# EAGLE design nolleblink2012_final (EAGLE 5.11)
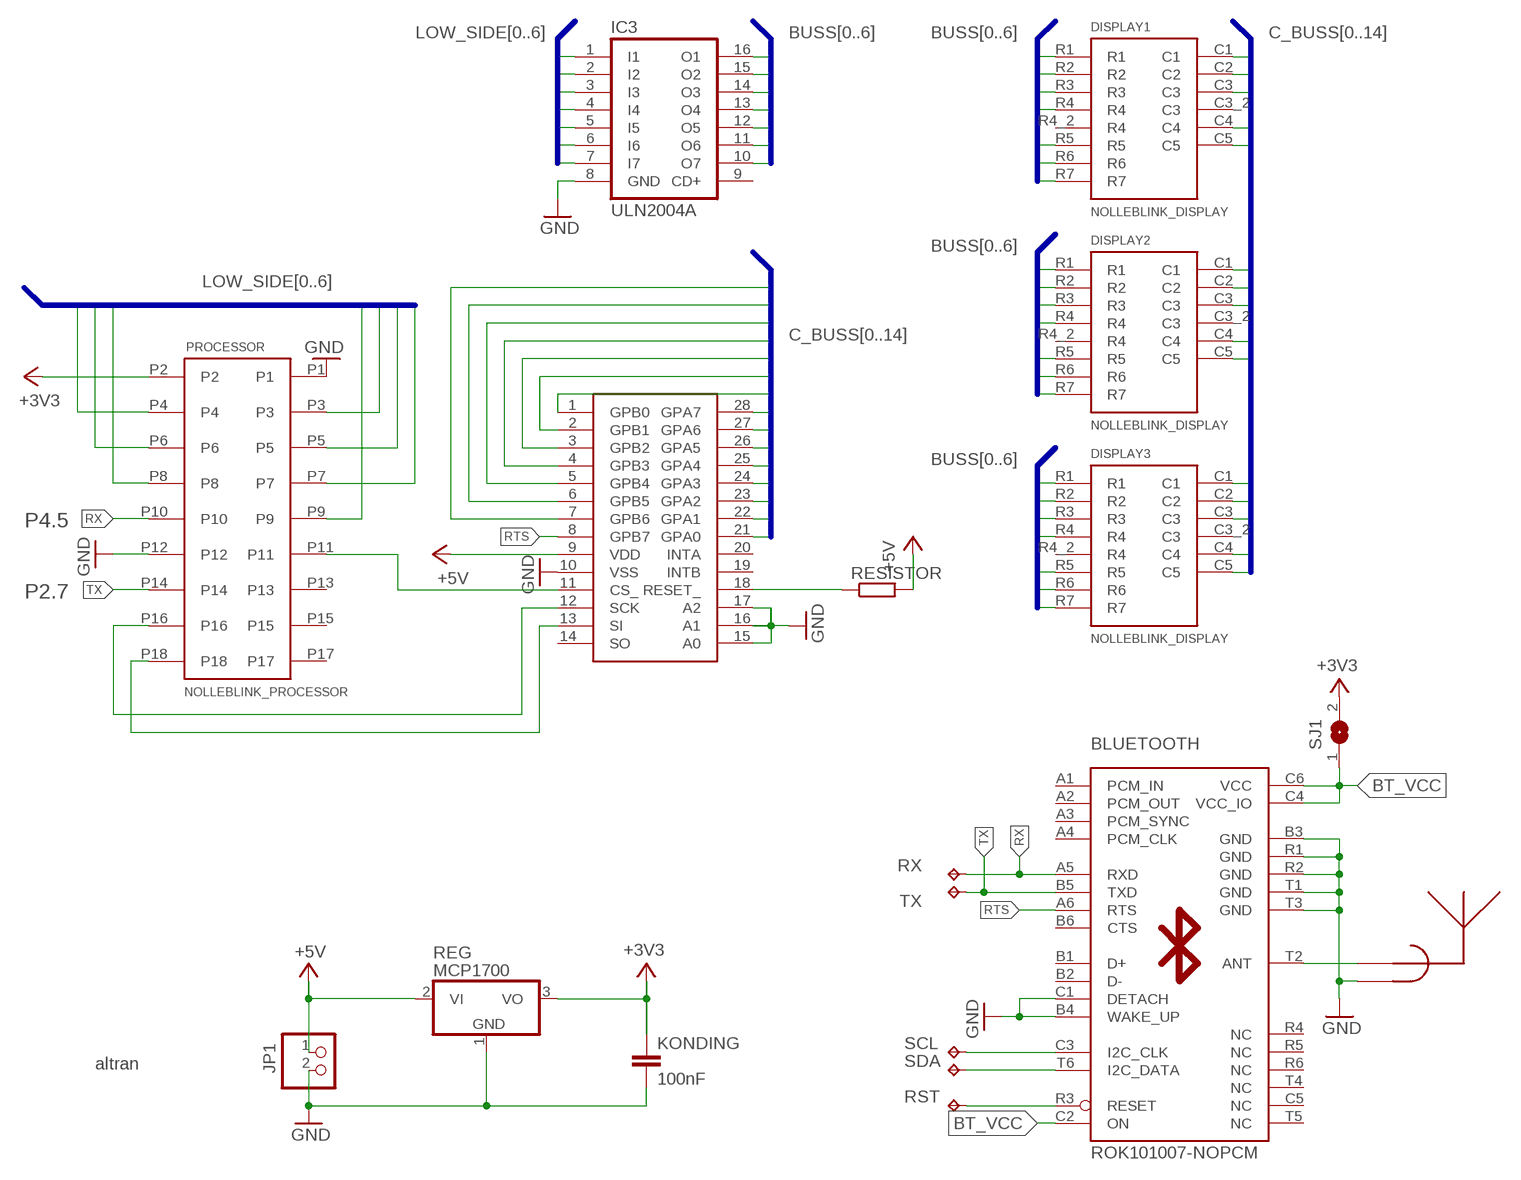
[diagram p0: schematic, sheet 1]

## Parts
BLUETOOTH  ROK101007-NOPCM  [ROK101007_NOPCM]
DISPLAY1  NOLLEBLINK_DISPLAY  [KINGBRIGHT_TA12-11EWA]
DISPLAY2  NOLLEBLINK_DISPLAY  [KINGBRIGHT_TA12-11EWA]
DISPLAY3  NOLLEBLINK_DISPLAY  [KINGBRIGHT_TA12-11EWA]
IC2  MCPS23S17  [MCP23S17]
IC3  ULN2004A  ULN2004AN  [DIL16]
JP1  PINHD-1X2  [1X02]
KONDING  100nF  C-EU050-030X075  [C050-030X075]
PROCESSOR  NOLLEBLINK_PROCESSOR  [CON_18_NOLLEBLINK]
REG  MCP1700  MCP_REGULATOR  [TO92_REGULATOR]
RESISTOR  R-EU_0207/10  [0207/10]
RST  TPTP12SQ  [TP12SQ]
RX  TPTP20SQ  [TP20SQ]
SCL  TPTP12SQ  [TP12SQ]
SDA  TPTP12SQ  [TP12SQ]
SJ1  SJ  [SJ]
TX  TPTP20SQ  [TP20SQ]
U$1  ALTRAN  [ALTRAN]
U$3  INV_F_24  [INV_F_ANTENNA]

## Nets
+3V3: KONDING.1 PROCESSOR.P2 REG.3(VO) SJ1.2
+5V: IC2.9(VDD) JP1.1 REG.2(VI) RESISTOR.2
BT_VCC: BLUETOOTH.C2(ON) BLUETOOTH.C4(VCC_IO) BLUETOOTH.C6(VCC) SJ1.1
BUSS0: DISPLAY1.R1 DISPLAY2.R1 DISPLAY3.R1 IC3.16(O1)
BUSS1: DISPLAY1.R2 DISPLAY2.R2 DISPLAY3.R2 IC3.15(O2)
BUSS2: DISPLAY1.R3 DISPLAY2.R3 DISPLAY3.R3 IC3.14(O3)
BUSS3: DISPLAY1.R4 DISPLAY2.R4 DISPLAY3.R4 IC3.13(O4)
BUSS4: DISPLAY1.R5 DISPLAY2.R5 DISPLAY3.R5 IC3.12(O5)
BUSS5: DISPLAY1.R6 DISPLAY2.R6 DISPLAY3.R6 IC3.11(O6)
BUSS6: DISPLAY1.R7 DISPLAY2.R7 DISPLAY3.R7 IC3.10(O7)
C_BUSS0: DISPLAY1.C1 IC2.21(GPA0)
C_BUSS1: DISPLAY1.C2 IC2.22(GPA1)
C_BUSS2: DISPLAY1.C3 IC2.23(GPA2)
C_BUSS3: DISPLAY1.C4 IC2.24(GPA3)
C_BUSS4: DISPLAY1.C5 IC2.25(GPA4)
C_BUSS5: DISPLAY2.C1 IC2.26(GPA5)
C_BUSS6: DISPLAY2.C2 IC2.27(GPA6)
C_BUSS7: DISPLAY2.C3 IC2.28(GPA7)
C_BUSS8: DISPLAY2.C4 IC2.1(GPB0)
C_BUSS9: DISPLAY2.C5 IC2.2(GPB1)
C_BUSS10: DISPLAY3.C1 IC2.3(GPB2)
C_BUSS11: DISPLAY3.C2 IC2.4(GPB3)
C_BUSS12: DISPLAY3.C3 IC2.5(GPB4)
C_BUSS13: DISPLAY3.C4 IC2.6(GPB5)
C_BUSS14: DISPLAY3.C5 IC2.7(GPB6)
GND: BLUETOOTH.B3(GND) BLUETOOTH.B4(WAKE_UP) BLUETOOTH.C1(DETACH) BLUETOOTH.R1(GND) BLUETOOTH.R2(GND) BLUETOOTH.T1(GND) BLUETOOTH.T3(GND) IC2.10(VSS) IC2.15(A0) IC2.16(A1) IC2.17(A2) IC3.8(GND) JP1.2 KONDING.2 PROCESSOR.P1 PROCESSOR.P12 REG.1(GND) U$3.GND
LOW_SIDE0: IC3.7(I7) PROCESSOR.P3
LOW_SIDE1: IC3.6(I6) PROCESSOR.P4
LOW_SIDE2: IC3.5(I5) PROCESSOR.P5
LOW_SIDE3: IC3.4(I4) PROCESSOR.P6
LOW_SIDE4: IC3.3(I3) PROCESSOR.P7
LOW_SIDE5: IC3.2(I2) PROCESSOR.P8
LOW_SIDE6: IC3.1(I1) PROCESSOR.P9
N$1: IC2.11(CS_) PROCESSOR.P11
N$2: IC2.13(SI) PROCESSOR.P18
N$3: IC2.12(SCK) PROCESSOR.P16
N$4: IC2.18(RESET_) RESISTOR.1
N$5: BLUETOOTH.T2(ANT) U$3.FEED(RF)
N$6: BLUETOOTH.C3(I2C_CLK) SCL.TP
N$7: BLUETOOTH.T6(I2C_DATA) SDA.TP
N$8: BLUETOOTH.R3(RESET) RST.TP
RTS: BLUETOOTH.A6(RTS) IC2.8(GPB7)
RX: BLUETOOTH.A5(RXD) PROCESSOR.P10 RX.TP
TX: BLUETOOTH.B5(TXD) PROCESSOR.P14 TX.TP
Unconnected: BLUETOOTH.A1(PCM_IN) BLUETOOTH.A2(PCM_OUT) BLUETOOTH.A3(PCM_SYNC) BLUETOOTH.A4(PCM_CLK) BLUETOOTH.B1(D+) BLUETOOTH.B2(D-) BLUETOOTH.B6(CTS) BLUETOOTH.C5(NC) BLUETOOTH.R4(NC) BLUETOOTH.R5(NC) BLUETOOTH.R6(NC) BLUETOOTH.T4(NC) BLUETOOTH.T5(NC) DISPLAY1.C3_2(C3) DISPLAY1.R4_2(R4) DISPLAY2.C3_2(C3) DISPLAY2.R4_2(R4) DISPLAY3.C3_2(C3) DISPLAY3.R4_2(R4) IC2.14(SO) IC2.19(INTB) IC2.20(INTA) IC3.9(CD+) PROCESSOR.P13 PROCESSOR.P15 PROCESSOR.P17

## Buses
BUSS[0..6]
LOW_SIDE[0..6]
C_BUSS[0..14]

## Notes on the sheet
- P4.5
- P2.7

## Library data of the parts
BLUETOOTH = etf-ericsson-bluetooth:ROK101007: Ericsson ROK 101 007 Bluetooth Module F*ck yeah! 110215 kongo@etf.nu
DISPLAY1-DISPLAY3 = stefan:NOLLEBLINK_DISPLAY: Nolleblinkmojt Display 2009 www.etf.nu
IC2 = microchip2:MCPS23S17
IC3 = uln-udn:ULN2004A: DRIVER ARRAY
JP1 = pinhead:PINHD-1X2: PIN HEADER
KONDING = rcl:C-EU: CAPACITOR, European symbol
PROCESSOR = stefan:NOLLEBLINK_PROCESSOR: Texas Instruments Development Board Nolleblinkmojt 2009 www.etf.nu
REG = ag:MCP_REGULATOR
RESISTOR = rcl:R-EU_: RESISTOR, European symbol
RST RX SCL SDA TX = testpad:TP: Test pad
SJ1 = jumper:SJ: SMD solder JUMPER
U$1 = mine:ALTRAN
U$3 = inverted_f:INV_F_24

## Board
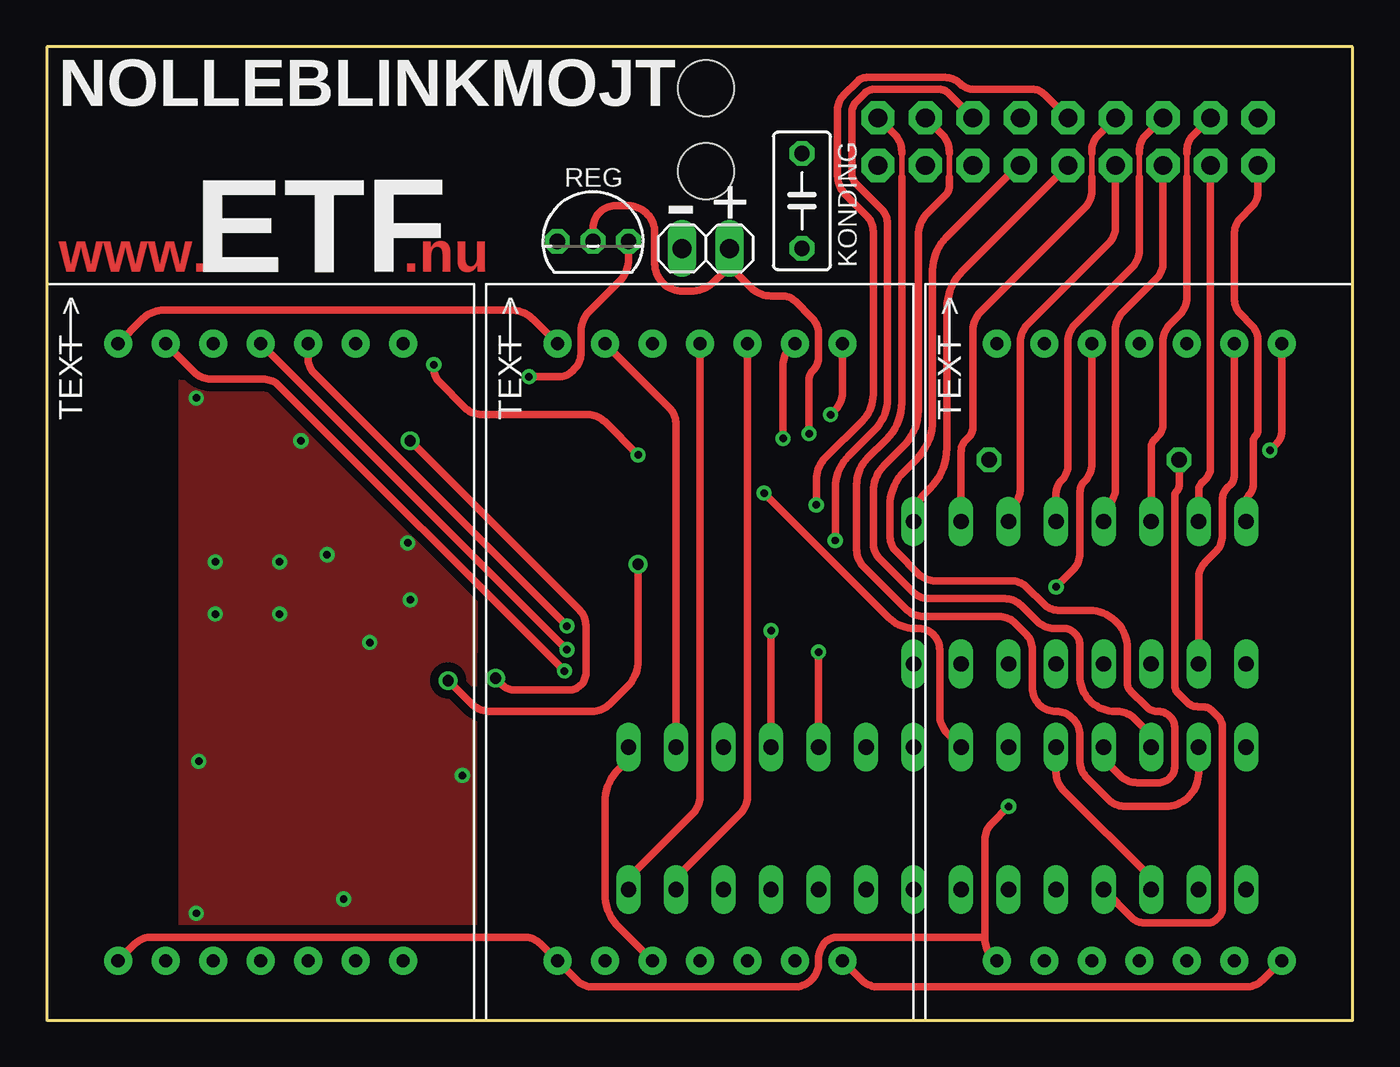
[diagram p1: board, top side]
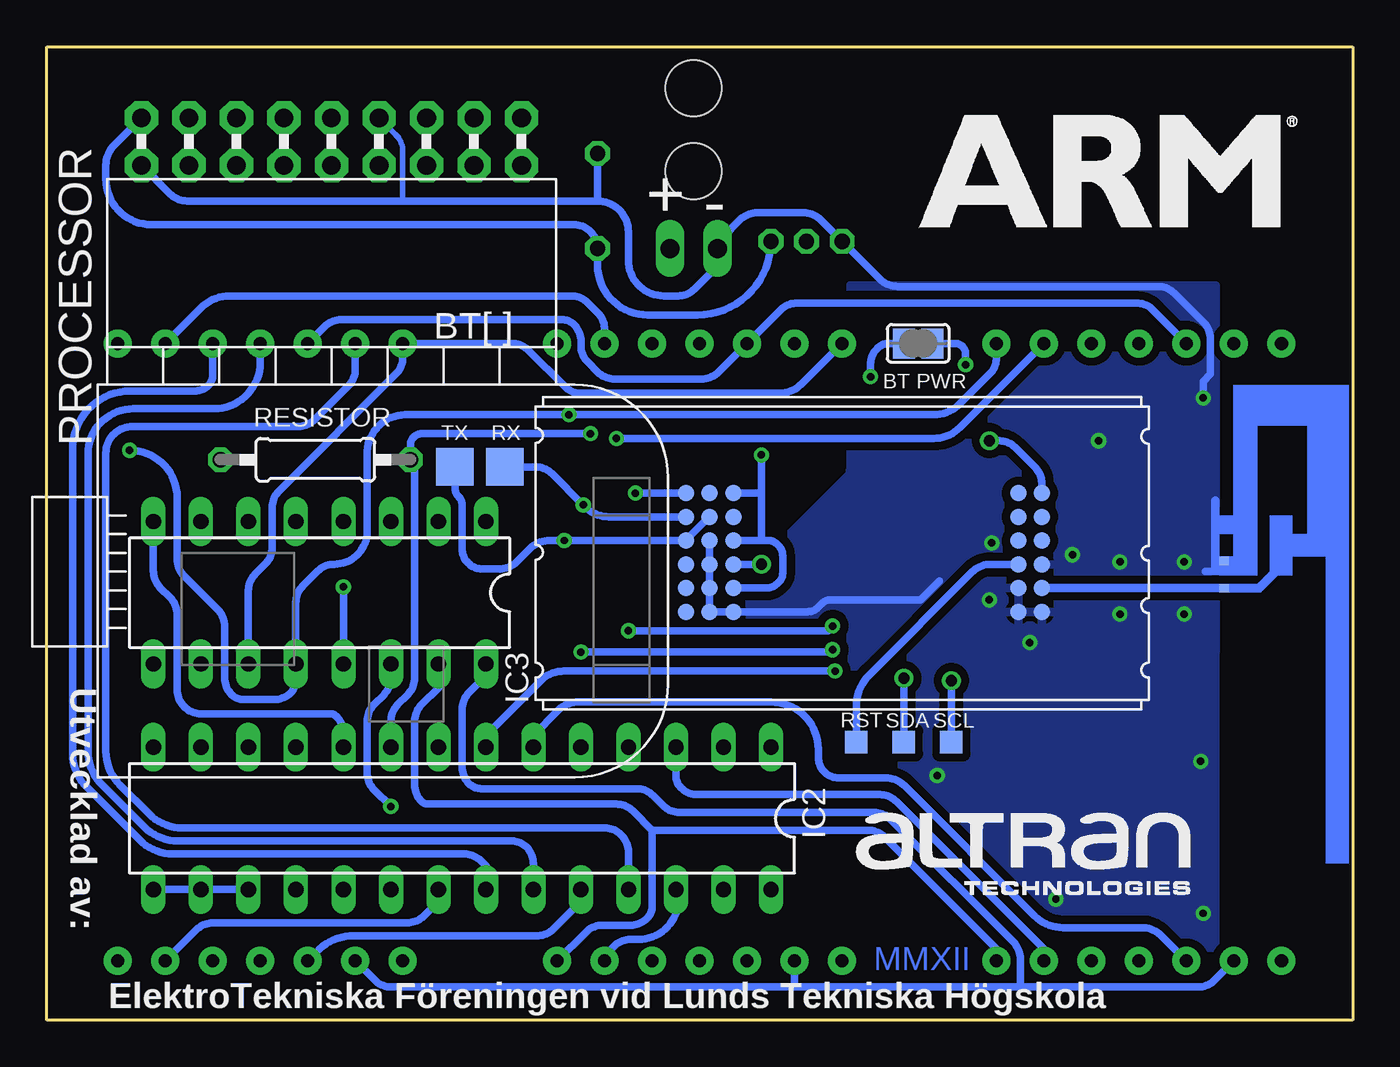
[diagram p2: board, bottom side, seen from below]

Size 69.84 x 52.06 mm. Coordinates in mm from the lower left corner, seen from the top.
Outline: 0,0 69.84,0 69.84,52.06 0,52.06 0,0
Copper layers (1*16): Top 0.035mm / dielectric 1.5mm / Bottom 0.035mm
Design rules "default": minimum track width 10mil, minimum drill 24mil, track to track 8mil, track to pad 8mil, pad to pad 8mil, via to via 8mil, smd to smd 8mil, copper to edge 40mil, drill to drill 8mil, minimum pad ring 10mil, minimum via ring 8mil, stop-mask expansion 4mil, vias tented up to drill 0mil, thermal gap 10mil
Holes 3 mm at 35.24,49.85 35.24,45.4

### Footprints (pad centres in the part's own frame; a part is rotated, then mirrored left to right if it is on the bottom)
ROK101007_NOPCM = smd 0.889 x 0.889: A1 24.76,-3.12; A2 24.76,-4.39; A3 24.76,-5.66; A4 24.76,-6.93; A5 24.76,-8.2; A6 24.76,-9.47; B1 23.5,-3.12; B2 23.5,-4.39; B3 23.5,-5.66; B4 23.5,-6.93; B5 23.5,-8.2; B6 23.5,-9.47; C1 22.22,-3.12; C2 22.22,-4.39; C3 22.22,-5.66; C4 22.22,-6.93; C5 22.22,-8.2; C6 22.22,-9.47; R1 6.98,-3.12; R2 6.98,-4.39; R3 6.98,-5.66; R4 6.98,-6.93; R5 6.98,-8.2; R6 6.98,-9.47; T1 5.72,-3.12; T2 5.72,-4.39; T3 5.72,-5.66; T4 5.72,-6.93; T5 5.72,-8.2; T6 5.72,-9.47
KINGBRIGHT_TA12-11EWA = drill 0.7 pad 1.5 round: C1 5.08,-16.51; C2 2.54,16.51; C3 0,16.51; C3_2 0,-16.51; C4 -2.54,-16.51; C5 -5.08,16.51; R1 -5.08,-16.51; R2 7.62,-16.51; R3 -7.62,-16.51; R4 -2.54,16.51; R4_2 2.54,-16.51; R5 7.62,16.51; R6 -7.62,16.51; R7 5.08,16.51
MCP23S17 = drill 0.813 long: 1 -12.7,-3.81; 2 -10.16,-3.81; 3 -7.62,-3.81; 4 -5.08,-3.81; 5 -2.54,-3.81; 6 0,-3.81; 7 2.54,-3.81; 8 5.08,-3.81; 9 7.62,-3.81; 10 10.16,-3.81; 11 12.7,-3.81; 12 15.24,-3.81; 13 17.78,-3.81; 14 20.32,-3.81; 15 20.32,3.81; 16 17.78,3.81; 17 15.24,3.81; 18 12.7,3.81; 19 10.16,3.81; 20 7.62,3.81; 21 5.08,3.81; 22 2.54,3.81; 23 0,3.81; 24 -2.54,3.81; 25 -5.08,3.81; 26 -7.62,3.81; 27 -10.16,3.81; 28 -12.7,3.81
DIL16 = drill 0.813 long: 1 -8.89,-3.81; 2 -6.35,-3.81; 3 -3.81,-3.81; 4 -1.27,-3.81; 5 1.27,-3.81; 6 3.81,-3.81; 7 6.35,-3.81; 8 8.89,-3.81; 9 8.89,3.81; 10 6.35,3.81; 11 3.81,3.81; 12 1.27,3.81; 13 -1.27,3.81; 14 -3.81,3.81; 15 -6.35,3.81; 16 -8.89,3.81
1X02 = drill 1.016 long: 1 -1.27,0; 2 1.27,0
C050-030X075 = drill 0.813 octagon: 1 -2.54,0; 2 2.54,0
CON_18_NOLLEBLINK = drill 1 pad 1.778 octagon: P1 10.16,1.27; P2 10.16,-1.27; P3 7.62,1.27; P4 7.62,-1.27; P5 5.08,1.27; P6 5.08,-1.27; P7 2.54,1.27; P8 2.54,-1.27; P9 0,1.27; P10 0,-1.27; P11 -2.54,1.27; P12 -2.54,-1.27; P13 -5.08,1.27; P14 -5.08,-1.27; P15 -7.62,1.27; P16 -7.62,-1.27; P17 -10.16,1.27; P18 -10.16,-1.27
TO92_REGULATOR = drill 0.813 octagon: 1 -1.905,0; 2 0,0; 3 1.905,0
0207/10 = drill 0.813 octagon: 1 -5.08,0; 2 5.08,0
TP12SQ = smd 1.2 x 1.2: TP 0,0
TP20SQ = smd 2 x 2: TP 0,0
SJ = smd 1.168 x 1.6: 1 -0.762,0; 2 0.762,0
INV_F_ANTENNA = smd 0.46 x 0.5: FEED 10.86,0.253; GND 9.413,0.25

### Placement (x,y rotation side)
BLUETOOTH  10.9,18.72 180 bottom
DISPLAY1  58.42,19.68 0 top
DISPLAY2  34.92,19.68 0 top
DISPLAY3  11.43,19.68 0 top
IC2  43.81,10.79 180 bottom
IC3  55.24,22.86 180 bottom
JP1  35.24,41.27 180 top
KONDING  40.39,43.81 90 top
PROCESSOR  54.61,46.99 180 bottom
REG  29.21,41.66 0 top
RESISTOR  55.47,29.97 0 bottom
RST  26.54,14.86 0 bottom
RX  45.34,29.59 0 bottom
SCL  21.46,14.86 90 bottom
SDA  24,14.86 90 bottom
SJ1  23.24,36.2 180 bottom
TX  48.01,29.59 0 bottom
U$1  5.33,3.79 0 top
U$2  [ARM]  13.2,44.96 0 bottom
U$3  7.13,33.97 270 bottom

### Tracks (layer width: path | path; a pad name or v marks a point on that pad's centre or on a via)
+3V3  (via drill 0.4)
  Top 0.406: v25.78,34.42 27.39,34.42 arc45 28.11,34.72 28.21,34.81 arc45 28.57,35.7 28.57,36.85 arc-45 29.01,37.9 30.63,39.52 arc45 31.11,40.69 REG.3
  Bottom 0.305: 65.4,47.63 PROCESSOR.P2 | 64.14,42.55 64.24,42.55
  Bottom 0.406: REG.3 arc90 35.05,37.72 37.71,37.72 arc90 40.39,40.39 KONDING.1 arc-90 41.66,42.55 64.14,42.55 | 64.24,42.55 arc90 66.67,44.98 66.67,45.72 arc45 66.23,46.8 65.4,47.63 | SJ1.2 24.81,36.2 arc-45 25.38,35.96 25.48,35.86 arc-45 25.78,35.14 v25.78,34.42
+5V  (via drill 0.4)
  Top 0.406: v40.77,31.37 40.77,34.27 arc-45 40.96,34.74 arc45 41.27,35.5 41.27,36.64 arc45 40.87,37.61 40.05,38.44 arc45 39.33,38.73 38.73,38.73 arc-45 37.65,39.18 36.9,39.93 arc-45 36.51,40.88 JP1.1 | REG.2 29.21,42.36 arc-90 30.41,43.56 31.07,43.56 arc-90 32.51,42.12 32.51,40.47 arc90 33.99,38.99 34.43,38.99 arc45 35.71,39.52 36.15,39.96 arc45 36.58,40.99 36.58,41.21 JP1.1 | JP1.1 36.45,41.34
  Bottom 0.406: IC2.9 51.44,15.98 arc45 51.06,16.88 50.54,17.41 arc-45 50.16,18.31 50.16,29.74 RESISTOR.2 50.39,30.75 arc90 49.78,31.37 v40.77,31.37
BT_VCC  (via drill 0.4)
  Top 0.406: v31.62,30.23 29.84,32.01 arc45 28.93,32.38 23.28,32.38 arc-45 22.34,32.77 21,34.12 arc-45 20.7,34.84 v20.7,35.05
  Bottom 0.406: 31.62,28.19 BLUETOOTH.C6 | 31.62,25.65 BLUETOOTH.C4 | 31.62,28.19 31.62,25.65 | v31.62,30.23 31.62,28.19 | v20.7,35.05 20.7,35.63 arc-90 21.27,36.2 SJ1.1 | BLUETOOTH.C2 31.4,23.11 arc-45 30.7,23.4 30.7,23.41 arc-45 30.48,23.93 30.48,24.81 arc-45 30.71,25.38 30.82,25.49 arc-45 31.22,25.65 31.62,25.65
BUSS0
  Bottom 0.406: IC3.16 46.35,18.41 47.25,17.52 arc-45 47.62,16.62 47.62,13.54 arc-45 47.25,12.65 arc-45 46.62,12.38 38.31,12.38 arc45 37.41,12.01 36.88,11.48 arc-45 35.99,11.11 25.61,11.11 arc45 24.71,10.74 18.15,4.18 arc45 17.78,3.28 17.78,1.78 | 17.78,1.78 29.84,1.78 | 29.84,1.78 DISPLAY2.R1 | 29.84,1.78 51.42,1.78 arc45 52.31,2.15 DISPLAY1.R1 | 17.78,1.78 8.27,1.78 arc-45 7.38,2.15 DISPLAY3.R1
BUSS1
  Top 0.406: DISPLAY2.R2 43.57,2.15 arc45 44.47,1.78 64.12,1.78 arc45 65.02,2.15 DISPLAY1.R2
  Bottom 0.406: IC3.15 48.9,17.78 49.79,16.88 arc-45 50.16,15.98 50.16,12.59 arc-45 49.79,11.69 arc-45 49.47,11.56 39.39,11.56 arc45 38.49,11.19 37.47,10.16 | 37.47,10.16 37.47,6.09 arc45 37.73,5.45 arc45 38.63,5.08 40.11,5.08 arc-45 41.01,4.71 DISPLAY2.R2 | DISPLAY3.R2 19.05,3.81 25.03,9.79 arc-45 25.93,10.16 37.47,10.16
BUSS2  (via drill 0.4)
  Top 0.406: 50.16,4.45 50.16,9.63 arc-45 50.54,10.53 v51.44,11.43 | 50.16,4.45 50.16,4.34 arc45 50.54,3.44 DISPLAY1.R3 | DISPLAY3.R3 4.71,4.07 arc-45 5.61,4.45 25.51,4.45 arc-45 26.41,4.07 DISPLAY2.R3 28.33,2.15 arc45 29.23,1.78 39.99,1.78 arc45 40.88,2.15 40.9,2.17 arc45 41.27,3.07 41.27,3.28 arc-45 41.65,4.18 arc-45 42.28,4.45 50.16,4.45
  Bottom 0.406: v51.44,11.43 52.33,12.33 arc45 52.7,13.23 52.7,15.98 arc45 52.33,16.88 51.81,17.41 arc-45 51.44,18.31 IC3.14
BUSS3  (via drill 0.4)
  Top 0.406: v53.98,23.18 54.87,24.08 arc45 55.24,24.97 55.24,28.2 arc-45 55.51,28.84 arc45 55.88,29.74 DISPLAY1.R4
  Bottom 0.406: v53.98,23.18 IC3.13 | DISPLAY3.R4 10.68,37.98 arc-45 11.57,38.35 29.7,38.35 arc-45 30.6,37.98 DISPLAY2.R4 33.92,34.66 arc45 34.82,34.29 39.48,34.29 arc45 40.38,34.66 40.9,35.19 arc45 41.27,36.09 41.27,36.3 arc-45 41.65,37.2 arc-45 42.28,37.47 54.08,37.47 arc-45 54.98,37.09 DISPLAY1.R4
BUSS4  (via drill 0.4)
  Top 0.406: v65.41,30.48 65.78,30.85 arc45 66.04,31.49 DISPLAY1.R5 | v41.91,32.38 42.17,32.65 arc45 42.55,33.55 DISPLAY2.R5
  Bottom 0.406: DISPLAY3.R5 19.05,35.45 arc45 19.42,34.55 21,32.97 arc45 22.42,32.38 v41.91,32.38 50.67,32.38 arc-90 52.7,30.23 52.7,26.14 arc90 54.47,24.38 arc-45 55.36,24.01 56.14,23.23 arc-45 56.52,22.33 IC3.12 56.52,18.15 arc45 56.78,17.52 arc45 57.68,17.14 59.32,17.14 arc45 59.95,17.41 arc45 60.33,18.31 60.33,21.06 arc-45 60.7,21.96 62.49,23.76 arc45 62.87,24.66 62.87,27.94 arc-90 v65.41,30.48
BUSS5
  Top 0.406: DISPLAY3.R6 5.1,37.49 arc-45 6.27,37.97 24.8,37.97 arc-45 26.04,37.46 DISPLAY2.R6
  Bottom 0.406: IC3.11 59.05,22.97 arc45 58.68,23.87 58.16,24.39 arc-45 57.78,25.29 57.78,27.41 arc45 57.41,28.31 51.17,34.55 arc-45 50.8,35.45 DISPLAY1.R6 44.98,36.2 arc45 44.08,35.82 42.16,33.9 arc-45 41.26,33.53 30.62,33.53 arc-45 29.47,34.03 DISPLAY2.R6
BUSS6  (via drill 0.4)
  Top 0.406: IC3.10 61.59,23.6 arc-45 61.97,24.5 62.49,25.03 arc45 62.87,25.93 62.87,27.82 arc-45 63.14,28.48 63.32,28.65 arc45 63.5,29.1 DISPLAY1.R7 | v39.37,31.11 39.37,35.03 arc-45 39.74,35.93 DISPLAY2.R7
  Bottom 0.406: DISPLAY2.R7 40.01,36.94 arc-45 40.38,37.84 40.9,38.36 arc-45 41.8,38.73 60.04,38.73 arc-45 61.61,38.09 DISPLAY1.R7 | DISPLAY3.R7 21,31.7 arc45 22.42,31.11 v39.37,31.11
C_BUSS0
  Bottom 0.406: IC2.21 48.9,6.35 49.67,5.58 arc45 50.56,5.21 60.94,5.21 arc-45 61.84,4.83 DISPLAY1.C1
C_BUSS1
  Bottom 0.406: IC2.22 46.35,8.26 46.62,8.52 arc-45 47.52,8.89 63.08,8.89 arc45 64.88,9.63 67.71,12.46 arc45 68.45,14.26 68.45,30.55 arc90 65.35,33.66 61.86,33.66 arc-90 60.96,34.55 DISPLAY1.C2
C_BUSS2
  Bottom 0.406: IC2.23 43.81,8.36 arc-45 44.19,9.26 arc-45 44.98,9.59 62.83,9.59 arc45 64.62,10.33 66.88,12.59 arc45 67.63,14.39 67.63,30.29 arc90 65.21,32.7 60.9,32.7 arc-90 58.42,35.18 DISPLAY1.C3
C_BUSS3
  Bottom 0.406: IC2.24 41.27,6.35 42.74,4.88 arc45 43.64,4.51 53.62,4.51 arc-45 55.42,3.64 DISPLAY1.C4
C_BUSS4
  Bottom 0.406: IC2.25 38.73,9 arc-45 39.11,9.9 39.12,9.91 arc-45 40.02,10.29 62.58,10.29 arc45 64.37,11.03 65.93,12.59 arc45 66.67,14.39 66.67,30.33 arc90 65.25,31.75 56.41,31.75 arc-45 55.51,32.12 53.71,33.92 arc-45 53.34,34.82 DISPLAY1.C5
C_BUSS5
  Bottom 0.406: IC2.26 36.2,5.71 36.22,5.65 arc68 38.21,4.32 38.6,4.32 arc-61 39.74,3.65 DISPLAY2.C1
C_BUSS6
  Top 0.406: IC2.27 33.66,7.62 37.09,11.06 arc45 37.47,11.96 DISPLAY2.C2
C_BUSS7
  Top 0.406: IC2.28 31.11,7.62 34.55,11.06 arc45 34.92,11.96 DISPLAY2.C3
C_BUSS8
  Top 0.406: DISPLAY2.C4 30.59,4.97 arc-45 29.84,6.77 29.84,11.65 arc-45 30.59,13.44 31.11,13.97 IC2.1
C_BUSS9
  Top 0.406: IC2.2 33.66,31.86 arc45 33.28,32.76 DISPLAY2.C5
C_BUSS10
  Bottom 0.406: IC2.3 36.2,13.07 arc-45 35.93,12.44 arc-45 35.03,12.06 25.29,12.06 arc45 24.39,11.69 16.51,3.81 DISPLAY3.C1
C_BUSS11  (via drill 0.4)
  Top 0.406: v38.73,20.83 IC2.4 | DISPLAY3.C2 13.97,35.45 arc45 14.34,34.55 v27.81,21.08
  Bottom 0.406: v27.81,21.08 28.07,20.83 v38.73,20.83
C_BUSS12  (via drill 0.4)
  Top 0.406: v41.27,19.68 IC2.5 | v27.81,19.81 DISPLAY3.C3
  Bottom 0.406: v27.81,19.81 27.94,19.68 v41.27,19.68
C_BUSS13
  Bottom 0.406: IC2.6 43.81,15.24 42.48,16.57 arc45 41.41,17.02 31.11,17.02 arc90 28.57,14.49 28.57,14.05 arc-90 27.48,12.95 24.98,12.95 arc45 23.96,12.53 17.02,5.59 arc-45 15.49,4.95 11.31,4.95 arc45 10.21,4.5 DISPLAY3.C4
C_BUSS14  (via drill 0.4)
  Top 0.406: DISPLAY3.C5 7.88,34.66 arc45 8.78,34.29 11.54,34.29 arc-45 12.44,33.92 v27.69,18.67
  Bottom 0.406: IC2.7 46.35,15.24 43.44,18.15 arc45 42.19,18.67 v27.69,18.67
GND  (via drill 0.4)
  Top 0.406: IC2.17 59.05,7.62 54.35,12.33 arc-45 53.98,13.23 IC2.10 | PROCESSOR.P1 64.77,44.34 arc-45 64.4,43.44 63.87,42.92 arc45 63.5,42.02 63.5,38.63 arc45 63.87,37.73 64.4,37.2 arc-45 64.77,36.3 64.77,31.56 arc-45 64.63,31.23 arc45 64.52,30.95 64.52,28.62 arc-45 64.31,28.11 arc45 64.14,27.7 IC3.8
  Bottom 0.305: 50.8,43.81 50.8,46.46 arc-45 51.17,47.36 PROCESSOR.P12
  Bottom 0.406: IC2.10 53.98,15.35 arc-45 54.35,16.25 arc-45 54.67,16.38 61.58,16.38 arc45 62.48,16.75 62.49,16.77 arc45 62.87,17.67 62.87,21.7 arc-45 63.24,22.6 63.76,23.12 arc45 64.14,24.02 IC3.8 | IC2.15 IC2.16 IC2.17 | PROCESSOR.P1 63.24,44.19 arc-45 62.34,43.81 50.8,43.81 40.39,43.81 | 40.39,43.81 KONDING.2 | 40.39,43.81 arc90 38.73,42.16 38.73,40.64 arc-90 36.83,38.73 36.09,38.73 arc-45 35.19,39.11 33.97,40.32 JP1.2 33.66,41.59 33.66,41.91 32.76,42.81 arc45 31.86,43.18 29.38,43.18 arc45 28.44,42.79 REG.1 25.29,39.64 arc-45 24.32,39.24 10.43,39.24 arc45 9.54,38.88 7.96,37.3 arc45 7.62,36.47 7.62,34.54 8,34.16 v8,33.27 | 6.86,24 7.87,24 | 22.1,23.5 23.11,22.48 27.96,22.48 arc-45 28.36,22.31 28.6,22.08 arc45 29.16,21.84 BLUETOOTH.C1 34.4,21.84 BLUETOOTH.B3 BLUETOOTH.B4
  Bottom 0.457: 7.36,24.56 7.36,27.8 | U$3.GND 7.36,24.56 | 7.36,24.56 7.36,24.03
  other vias: 12.45,24.51 9.02,24.51 9.02,21.72 12.45,21.72 17.27,20.19 19.43,22.48 8,5.71 14.99,24.89 19.3,25.53 8.13,13.84 15.88,6.48 13.59,30.99 22.23,13.08
  pour Bottom (isolate 0.432): 69.81,0 7.36,0 7.32,39.27 26.87,39.32 26.91,0.07
  pour Top (isolate 0.457): 7.25,-0.02 22.84,-0.02 22.86,39.32 7.25,39.32
  pour Bottom (isolate 0.457): 21.84,22.48 21.84,30.48 25.65,30.48 34.67,21.46 22.86,21.46
LOW_SIDE0
  Top 0.406: IC3.7 61.59,28.31 arc-45 61.78,28.76 61.79,28.77 arc45 62.23,29.47 PROCESSOR.P3
LOW_SIDE1
  Top 0.305: 60.96,45.09 60.96,46.35
  Top 0.406: 60.96,46.35 60.96,46.46 arc-45 61.33,47.36 PROCESSOR.P4 | 60.96,45.09 60.96,38.63 arc-45 60.59,37.73 60.06,37.2 arc45 59.69,36.3 59.69,31.84 arc-45 59.45,31.27 59.27,31.09 arc45 59.05,30.56 IC3.6
LOW_SIDE2
  Top 0.406: IC3.5 56.52,27.3 56.78,27.57 arc45 57.15,28.47 57.15,36.94 arc-45 57.52,37.84 59.32,39.63 arc45 59.69,40.53 PROCESSOR.P5
LOW_SIDE3
  Top 0.305: 58.42,45.09 58.42,46.35
  Top 0.406: IC3.4 53.98,28.2 arc-45 54.24,28.84 arc45 54.61,29.74 54.61,36.3 arc-45 54.98,37.2 58.05,40.27 arc45 58.42,41.17 58.42,45.09 | PROCESSOR.P6 58.79,47.36 arc45 58.42,46.46 58.42,46.35
LOW_SIDE4
  Top 0.406: IC3.3 51.44,27.3 51.7,27.57 arc45 52.07,28.47 52.07,36.3 arc-45 52.44,37.2 56.78,41.54 arc45 57.15,42.44 PROCESSOR.P7
LOW_SIDE5
  Top 0.305: 55.88,45.09 55.88,46.35
  Top 0.406: 55.88,45.09 55.88,44.34 arc-45 55.51,43.44 49.9,37.84 arc45 49.53,36.94 49.53,31.76 arc-45 49.27,31.12 49.13,30.99 arc45 48.9,30.42 IC3.2 | 55.88,46.35 55.88,46.46 arc-45 56.25,47.36 PROCESSOR.P8
LOW_SIDE6
  Top 0.406: PROCESSOR.P9 54.61,45.7 48.97,40.06 arc45 48.13,38.05 48.13,30.6 arc-45 47.24,28.44 46.98,28.19 arc45 IC3.1
N$1
  Top 0.406: IC2.11 56.52,13.97 57.41,13.07 arc45 58.31,12.7 59.43,12.7 arc90 60.33,13.6 60.33,15.61 arc90 59.43,16.51 arc-45 58.79,16.77 57.97,17.59 arc-45 57.78,18.04 57.78,19.88 arc90 55.75,21.91 54.18,21.91 arc-45 53.28,22.28 52.44,23.12 arc45 51.54,23.5 47.52,23.5 arc-45 46.62,23.87 45.46,25.03 arc-45 45.09,25.93 45.09,27.51 arc-45 45.84,29.33 46.48,29.97 arc45 47.37,32.13 47.37,40.11 arc-45 48.09,41.85 51.96,45.72 PROCESSOR.P11
N$2
  Top 0.305: 45.72,45.09 45.72,46.35
  Top 0.406: PROCESSOR.P18 45.35,47.36 arc-45 45.72,46.46 45.72,46.35 | IC2.13 61.59,13.23 arc-90 59.8,11.43 57.68,11.43 arc-45 56.78,11.8 55.62,12.96 arc-45 55.24,13.86 55.24,15.24 arc90 53.98,16.51 arc-90 52.7,17.78 52.7,19.79 arc45 52.33,20.69 51.81,21.22 arc45 50.91,21.59 46.88,21.59 arc-45 45.98,21.96 43.68,24.27 arc-45 43.31,25.16 43.31,28.63 arc-45 43.9,30.05 44.9,31.05 arc45 45.72,33.04 45.72,45.09
N$3
  Top 0.305: 48.26,45.09 48.26,46.35
  Top 0.406: IC2.12 59.05,15.24 58.16,16.14 arc45 57.26,16.51 57.15,16.51 | 57.15,16.51 57.04,16.51 | PROCESSOR.P16 47.89,47.36 arc-45 48.26,46.46 48.26,46.35 | 57.15,16.51 arc-90 55.24,18.41 55.24,20.06 arc90 54.35,20.95 53.87,20.95 arc-45 52.97,21.33 52.12,22.17 arc45 51.23,22.54 47.2,22.54 arc-45 46.3,22.91 44.57,24.65 arc-45 44.2,25.55 44.2,28.27 arc-45 44.77,29.66 45.81,30.7 arc45 46.61,32.63 46.61,41.97 arc-45 47.12,43.2 48.1,44.18 arc45 48.26,44.57 48.26,45.09
N$4
  Top 0.406: IC2.18 58.02,5.47 arc45 58.67,5.21 62.12,5.21 arc45 62.52,5.37 62.67,5.53 arc45 62.87,5.98 62.87,15.67 arc45 62.63,16.24 62.32,16.55 arc45 61.8,16.76 61.57,16.76 arc-45 60.97,17.01 60.52,17.46 arc-45 60.33,17.92 60.33,28.06 arc-45 60.42,28.29 arc45 60.55,28.61 RESISTOR.1
N$5
  Bottom 0.457: BLUETOOTH.T2 U$3.FEED
N$6  (via drill 0.6)
  Top 0.406: v21.46,18.16 22.66,16.96 arc45 23.76,16.51 29.16,16.51 arc45 30.11,16.91 31.05,17.84 arc45 31.62,19.23 v31.62,24.38
  Bottom 0.406: BLUETOOTH.C3 v31.62,24.38 | SCL.TP v21.46,18.16
N$7  (via drill 0.6)
  Top 0.406: v19.43,30.99 28.49,21.93 arc-45 28.83,21.11 28.83,18.57 arc-90 27.91,17.65 25.01,17.65 arc-45 24.38,17.92 v24,18.29
  Bottom 0.406: SDA.TP v24,18.29 | v19.43,30.99 18.9,30.99 arc45 18.07,30.64 16.94,29.52 arc45 16.64,28.78 16.64,28.2 BLUETOOTH.T6
N$8
  Bottom 0.406: BLUETOOTH.R3 19.35,24.38 arc-45 20.36,23.97 25.86,18.47 arc-45 26.54,16.81 RST.TP
RTS  (via drill 0.4)
  Top 0.406: IC2.8 48.17,15.33 arc-45 47.75,16.34 47.75,19.8 arc90 46.6,20.95 46.41,20.95 arc-45 45.01,21.54 v38.35,28.19
  Bottom 0.406: v38.35,28.19 BLUETOOTH.A6
RX  (via drill 0.4)
  Top 0.406: PROCESSOR.P10 53.37,49.5 arc45 52.69,49.78 49.56,49.78 arc-45 48.86,50.08 arc45 48.03,50.42 43.87,50.42 arc45 43.34,50.2 42.63,49.49 arc45 42.29,48.66 42.29,45.16 arc45 42.71,44.16 43.84,43.02 arc-45 44.2,42.17 44.2,33.47 arc-45 43.61,32.05 41.64,30.09 arc45 41.15,28.89 v41.15,27.56
  Bottom 0.406: BLUETOOTH.A5 39.78,26.92 arc45 41.03,27.44 v41.15,27.56 42.81,29.22 arc-45 43.7,29.59 RX.TP
TX  (via drill 0.4)
  Top 0.406: PROCESSOR.P14 48.2,49.59 arc45 47.74,49.78 44.23,49.78 arc45 43.74,49.58 43.31,49.16 arc45 43.05,48.53 43.05,45.29 arc45 43.29,44.72 44.64,43.37 arc-45 44.96,42.6 44.96,33.23 arc-45 44.27,31.57 42.87,30.17 arc45 42.16,28.47 v42.16,25.65
  Bottom 0.406: BLUETOOTH.B5 34.42,26.92 35.69,25.65 v42.16,25.65 42.92,25.65 arc-45 44.01,25.2 44.7,24.51 arc45 45.63,24.13 46.54,24.13 arc45 47.31,24.45 arc45 47.62,25.21 47.62,27.55 arc-45 47.81,28 arc45 48.01,28.46 TX.TP

### Text on the board
Top: www. | .nu
Bottom: MMXII
tPlace: ETF
tNames: NOLLEBLINKMOJT | - | +
bNames: - | + | BT[ ] | BT PWR | Utvecklad av: | ElektroTekniska Föreningen vid Lunds Tekniska Högskola
Document: FEL. TVÄRTOM ---> | --> | Halv millimeter för mycket?